# EAGLE schematic Paralelo74374_SingleDisp (EAGLE 9.3.2)
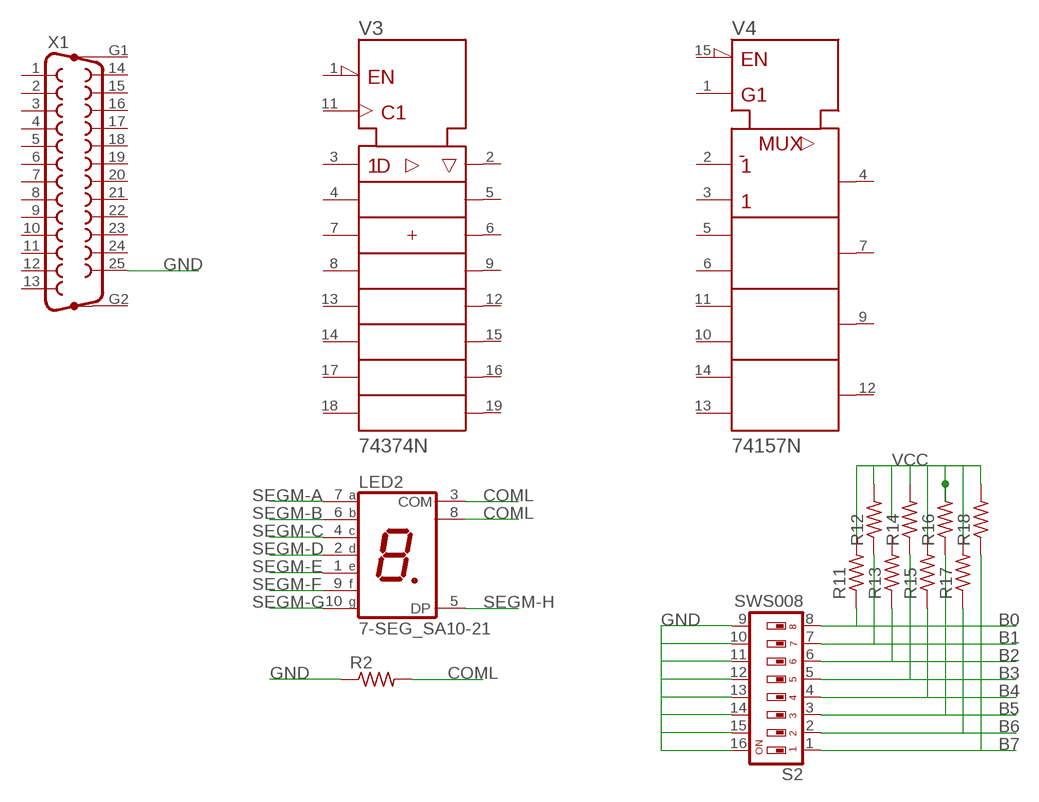
[diagram p0: schematic, sheet 1]

## Parts
LED2  7-SEG_SA10-21  [SA10-21]
R2  R-US_0204/5  [0204/5]
R11  R-US_0207/12  [0207/12]
R12  R-US_0207/12  [0207/12]
R13  R-US_0207/12  [0207/12]
R14  R-US_0207/12  [0207/12]
R15  R-US_0207/12  [0207/12]
R16  R-US_0207/12  [0207/12]
R17  R-US_0207/12  [0207/12]
R18  R-US_0207/12  [0207/12]
S2  SWS008  [SMS-008]
V3  74374N  [DIL20]
V4  74157N  [DIL16]
X1  F25HP  [F25HP]

## Nets
B0: R11.1 S2.8
B1: R12.1 S2.7
B2: R13.1 S2.6
B3: R14.1 S2.5
B4: R15.1 S2.4
B5: R16.1 S2.3
B6: R17.1 S2.2
B7: R18.1 S2.1
COML: LED2.3(COM) LED2.8(COM) R2.2
GND: R2.1 S2.9 S2.10 S2.11 S2.12 S2.13 S2.14 S2.15 S2.16 X1.25
SEGM-A: LED2.7(A)
SEGM-B: LED2.6(B)
SEGM-C: LED2.4(C)
SEGM-D: LED2.2(D)
SEGM-E: LED2.1(E)
SEGM-F: LED2.9(F)
SEGM-G: LED2.10(G)
SEGM-H: LED2.5(DP)
VCC: R11.2 R12.2 R14.2 R15.2 R16.2 R17.2 R18.2
Unconnected: R13.2 V3.1(!OC) V3.2(1Q) V3.3(1D) V3.4(2D) V3.5(2Q) V3.6(3Q) V3.7(3D) V3.8(4D) V3.9(4Q) V3.11(CLK) V3.12(5Q) V3.13(5D) V3.14(6D) V3.15(6Q) V3.16(7Q) V3.17(7D) V3.18(8D) V3.19(8Q) V4.1(!A!/B) V4.2(1A) V4.3(1B) V4.4(1Y) V4.5(2A) V4.6(2B) V4.7(2Y) V4.9(3Y) V4.10(3B) V4.11(3A) V4.12(4Y) V4.13(4B) V4.14(4A) V4.15(!G) X1.1 X1.2 X1.3 X1.4 X1.5 X1.6 X1.7 X1.8 X1.9 X1.10 X1.11 X1.12 X1.13 X1.14 X1.15 X1.16 X1.17 X1.18 X1.19 X1.20 X1.21 X1.22 X1.23 X1.24 X1.G1 X1.G2

## Power pins joined to a net without a drawn wire
+UB: V3.20(+UB) V4.16(+UB)
-UB: V3.10(-UB) V4.8(-UB)

## Library data of the parts
LED2 = display-kingbright:7-SEG_: Kingbright 14.2mm (0.56 INCH) SINGLE DIGIT NUMERIC DUISPLAY Source: SA56-11EWA(Ver1189471036.pdf; OC_FARNELL: unknown; OC_NEWARK: unknown
R2 R11-R18 = resistor:R-US_: RESISTOR, American symbol
S2 = smd-special:SWS008: SMD Dip Switch 8 pol.
V3 = 74ttl-din:74*374: Octal D type transparent LATCH, edge triggered
V4 = 74ttl-din:74*157: Quadruple 2-line to 1-line data SELECTOR/MULTIPLEXER
X1 = con-subd:F25HP: SUB-D; OC_FARNELL: unknown; OC_NEWARK: unknown